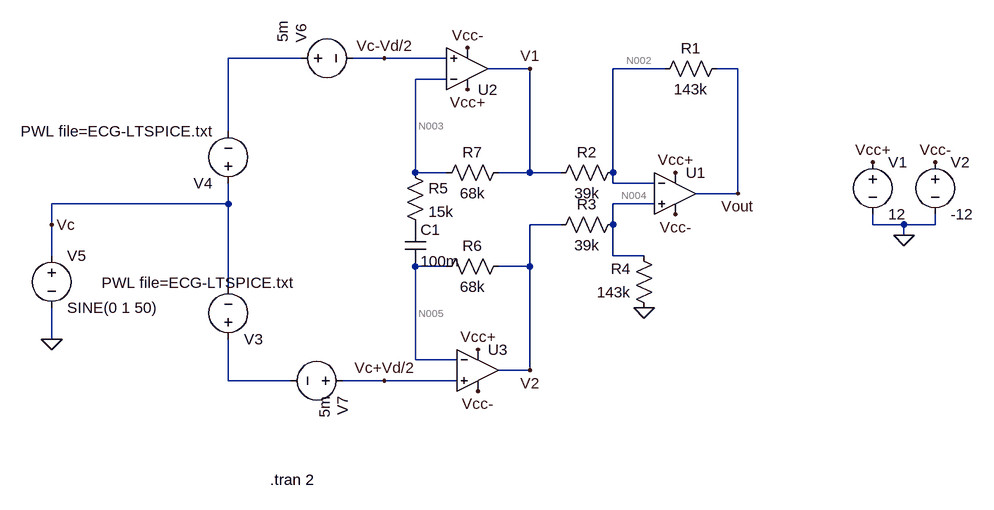
[diagram p0: schematic Zadatak2.asc]
Zadatak2.asc, the LTspice schematic file:
Version 4.1
SHEET 1 980 680
WIRE -64 0 -176 0
WIRE 64 0 16 0
WIRE 160 0 64 0
WIRE 288 16 224 16
WIRE 496 16 416 16
WIRE 608 16 576 16
WIRE 160 32 112 32
WIRE -176 112 -176 0
WIRE 112 176 112 32
WIRE 160 176 112 176
WIRE 288 176 288 16
WIRE 288 176 240 176
WIRE 336 176 288 176
WIRE 416 176 416 16
WIRE 416 192 416 176
WIRE 480 192 416 192
WIRE 608 208 608 16
WIRE 608 208 544 208
WIRE -176 224 -176 192
WIRE -176 224 -448 224
WIRE 480 224 416 224
WIRE -448 256 -448 224
WIRE 336 256 288 256
WIRE 416 256 416 224
WIRE 816 256 816 240
WIRE 864 256 816 256
WIRE 912 256 912 240
WIRE 912 256 864 256
WIRE 864 272 864 256
WIRE -448 304 -448 256
WIRE 416 304 416 256
WIRE 464 304 416 304
WIRE 160 320 112 320
WIRE 288 320 288 256
WIRE 288 320 240 320
WIRE -176 352 -176 224
WIRE -448 432 -448 384
WIRE 112 464 112 320
WIRE 176 464 112 464
WIRE 288 480 288 320
WIRE 288 480 240 480
WIRE -176 496 -176 432
WIRE -80 496 -176 496
WIRE 64 496 0 496
WIRE 176 496 64 496
FLAG 464 384 0
FLAG 864 272 0
FLAG 816 160 Vcc+
FLAG 512 176 Vcc+
FLAG 912 160 Vcc-
FLAG 512 240 Vcc-
FLAG 192 48 Vcc+
FLAG 208 448 Vcc+
FLAG 208 512 Vcc-
FLAG 192 -16 Vcc-
FLAG -448 432 0
FLAG -448 256 Vc
FLAG 64 496 Vc+Vd/2
FLAG 64 0 Vc-Vd/2
FLAG 608 208 Vout
FLAG 288 16 V1
FLAG 288 480 V2
SYMBOL Opamps\\UniversalOpamp2 512 208 R0
SYMATTR InstName U1
SYMBOL res 592 0 R90
WINDOW 0 0 56 VBottom 2
WINDOW 3 32 56 VTop 2
SYMATTR InstName R1
SYMATTR Value 143k
SYMBOL res 432 160 R90
WINDOW 0 0 56 VBottom 2
WINDOW 3 32 56 VTop 2
SYMATTR InstName R2
SYMATTR Value 39k
SYMBOL res 432 240 R90
WINDOW 0 0 56 VBottom 2
WINDOW 3 32 56 VTop 2
SYMATTR InstName R3
SYMATTR Value 39k
SYMBOL res 480 400 R180
WINDOW 0 36 76 Left 2
WINDOW 3 36 40 Left 2
SYMATTR InstName R4
SYMATTR Value 143k
SYMBOL voltage 816 144 R0
WINDOW 123 0 0 Left 0
WINDOW 39 0 0 Left 0
SYMATTR InstName V1
SYMATTR Value 12
SYMBOL voltage 912 144 R0
WINDOW 123 0 0 Left 0
WINDOW 39 0 0 Left 0
SYMATTR InstName V2
SYMATTR Value -12
SYMBOL Opamps\\UniversalOpamp2 192 16 M180
SYMATTR InstName U2
SYMBOL Opamps\\UniversalOpamp2 208 480 R0
SYMATTR InstName U3
SYMBOL voltage -176 448 M180
WINDOW 123 0 0 Left 0
WINDOW 39 0 0 Left 0
WINDOW 3 -195 103 Left 2
SYMATTR Value PWL file=ECG-LTSPICE.txt
SYMATTR InstName V3
SYMBOL voltage -176 208 R180
WINDOW 123 0 0 Left 0
WINDOW 39 0 0 Left 0
SYMATTR InstName V4
SYMATTR Value PWL file=ECG-LTSPICE.txt
SYMBOL voltage -448 288 R0
WINDOW 123 0 0 Left 0
WINDOW 39 0 0 Left 0
SYMATTR InstName V5
SYMATTR Value SINE(0 1 50)
SYMBOL voltage -80 0 R270
WINDOW 123 0 0 Left 0
WINDOW 39 0 0 Left 0
WINDOW 3 24 -12 Left 2
SYMATTR Value 5m
SYMATTR InstName V6
SYMBOL voltage 16 496 R90
WINDOW 123 0 0 Left 0
WINDOW 39 0 0 Left 0
WINDOW 3 24 44 Left 2
SYMATTR Value 5m
SYMATTR InstName V7
SYMBOL res 96 160 R0
SYMATTR InstName R5
SYMATTR Value 15k
SYMBOL cap 96 256 R0
SYMATTR InstName C1
SYMATTR Value 100m
SYMBOL res 256 304 R90
WINDOW 0 0 56 VBottom 2
WINDOW 3 32 56 VTop 2
SYMATTR InstName R6
SYMATTR Value 68k
SYMBOL res 256 160 R90
WINDOW 0 0 56 VBottom 2
WINDOW 3 32 56 VTop 2
SYMATTR InstName R7
SYMATTR Value 68k
TEXT -112 648 Left 2 !.tran 2

The netlist it stands for:
* Zadatak2.asc
X§U1 N004 N002 Vcc+ Vcc- Vout level.2 Avol=1Meg GBW=10Meg Slew=10Meg ilimit=25m rail=0 Vos=0 phimargin=45 en=0 enk=0 in=0 ink=0 Rin=500Meg  ; pins IN+ IN- V+ V- OUT
R1 Vout N002 143k
R2 N002 V1 39k
R3 N004 V2 39k
R4 0 N004 143k
V1 Vcc+ 0 12
V2 Vcc- 0 -12
X§U2 Vc-Vd/2 N003 Vcc+ Vcc- V1 level.2 Avol=1Meg GBW=10Meg Slew=10Meg ilimit=25m rail=0 Vos=0 phimargin=45 en=0 enk=0 in=0 ink=0 Rin=500Meg  ; pins IN+ IN- V+ V- OUT
X§U3 Vc+Vd/2 N005 Vcc+ Vcc- V2 level.2 Avol=1Meg GBW=10Meg Slew=10Meg ilimit=25m rail=0 Vos=0 phimargin=45 en=0 enk=0 in=0 ink=0 Rin=500Meg  ; pins IN+ IN- V+ V- OUT
V3 N006 Vc PWL file=ECG-LTSPICE.txt
V4 Vc N001 PWL file=ECG-LTSPICE.txt
V5 Vc 0 SINE(0 1 50)
V6 N001 Vc-Vd/2 5m
V7 Vc+Vd/2 N006 5m
R5 N003 P001 15k
C1 P001 N005 100m
R6 V2 N005 68k
R7 V1 N003 68k
.tran 2
.lib UniversalOpamps2.sub
.backanno
.end

* Results of the author's LTspice run, read from the files saved beside the schematic
* Operating Point, zero values left out:
*   V(n002) = 3.929 mV
*   V(n003) = -5 mV
*   V(n004) = 3.929 mV
*   V(n005) = 5 mV
*   V(p001) = -5 mV
*   V(v1) = -5.001 mV
*   V(v2) = 5.001 mV
*   V(vc+vd/2) = 5 mV
*   V(vc-vd/2) = -5 mV
*   V(vcc+) = 12 V
*   V(vcc-) = -12 V
*   V(vout) = 36.67 mV
*   I(R1) = 229 nA
*   I(R2) = 229 nA
*   I(R3) = -27.48 nA
*   I(R4) = -27.47 nA
*   I(R6) = 10 pA
*   I(R7) = -10 pA
*   I(V1) = -3.597 mA
*   I(V2) = 3.597 mA
*   I(V3) = -10 pA
*   I(V4) = -10 pA
*   I(V6) = -10 pA
*   I(V7) = -10 pA
*   Ix(u1:1) = 7.858 pA
*   Ix(u1:2) = 7.858 pA
*   Ix(u1:3) = 1.199 mA
*   Ix(u1:4) = -1.199 mA
*   Ix(u1:5) = -229 nA
*   Ix(u2:1) = -10 pA
*   Ix(u2:2) = -10 pA
*   Ix(u2:3) = 1.199 mA
*   Ix(u2:4) = -1.199 mA
*   Ix(u2:5) = 229 nA
*   Ix(u3:1) = 10 pA
*   Ix(u3:2) = 10 pA
*   Ix(u3:3) = 1.199 mA
*   Ix(u3:4) = -1.199 mA
*   Ix(u3:5) = -27.49 nA
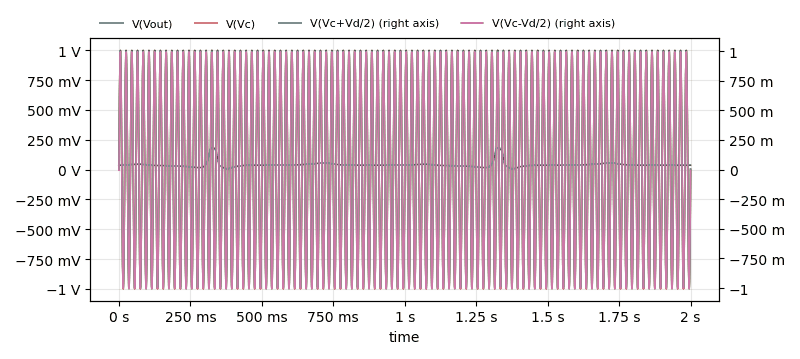
[diagram p1: Transient Analysis of Zadatak2.asc, plotted from the saved traces]
* Transient Analysis, 1 run:
*   V(Vout): min 5.773 mV, max 187.7 mV, average 40.38 mV, rms 47.09 mV, last 36.67 mV
*   V(Vc): min -999.6 mV, max 999.6 mV, average -5.179 µV, rms 709.2 mV, last 0 V
*   V(Vc+Vd/2): min -995 m, max 1.007 , average 5.045 m, rms 709.2 m, last 5 m
*   V(Vc-Vd/2): min -1.006 , max 995 m, average -5.056 m, rms 709.2 m, last -5 m